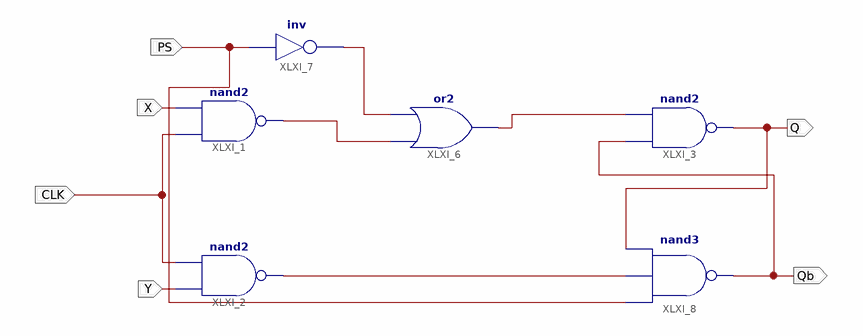
[diagram p0: schematic sheet 1]
// Xilinx ISE schematic Latch_1.sch (artix7) as structural Verilog: 6 symbols, 6 ports
module Latch_1 (
  input  PS,
  input  X,
  input  CLK,
  input  Y,
  output Q,
  output Qb
);

  wire XLXN_10, XLXN_11, XLXN_12, XLXN_14;

  nand XLXI_1 (XLXN_10, CLK, X);
  nand XLXI_2 (XLXN_14, Y, CLK);
  nand XLXI_3 (Q, Qb, XLXN_12);
  or XLXI_6 (XLXN_12, XLXN_10, XLXN_11);
  not XLXI_7 (XLXN_11, PS);
  nand XLXI_8 (Qb, PS, XLXN_14, Q);
endmodule
